# Altium schematic sheet Harness.SchDoc
size A4; SheetNumber: 10; SheetTotal: 10
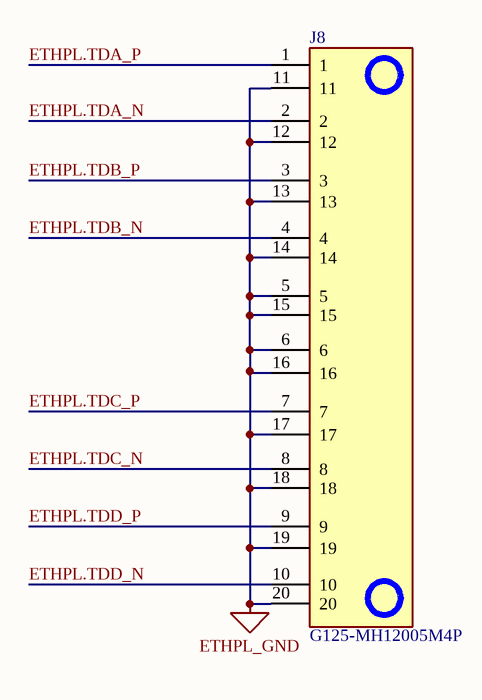
[diagram p0: Harness.SchDoc]

## Parts
J8  G125-MH12005M4P  [G125-MH12005M4P_1]

## Nets
ETHPL_GND: J8.5 J8.6 J8.11 J8.12 J8.13 J8.14 J8.15 J8.16 J8.17 J8.18 J8.19 J8.20
ETHPL.TDA_N: J8.2
ETHPL.TDA_P: J8.1
ETHPL.TDB_N: J8.4
ETHPL.TDB_P: J8.3
ETHPL.TDC_N: J8.8
ETHPL.TDC_P: J8.7
ETHPL.TDD_N: J8.10
ETHPL.TDD_P: J8.9

## Library data of the parts
J8 = G125-MH12005M4P: Connector; Manufacturer_Name: Harwin; Datasheet Link: https://content.harwin.com/m/667f1be9427fb768/original/DRG-02921-Technical-Drawing-Datasheet-G125-MH1XX05M4P-pdf.pdf; Height: 5.3mm; Manufacturer_Part_Number: G125-MH12005M4P; Mouser Part Number: 855-G125MH1205M4PM4P; Mouser Price/Stock: https://www.mouser.co.uk/ProductDetail/Harwin/G125-MH12005M4P?qs=vHuUswq2%252Bsy%252BkqY0DryK%2FQ%3D%3D